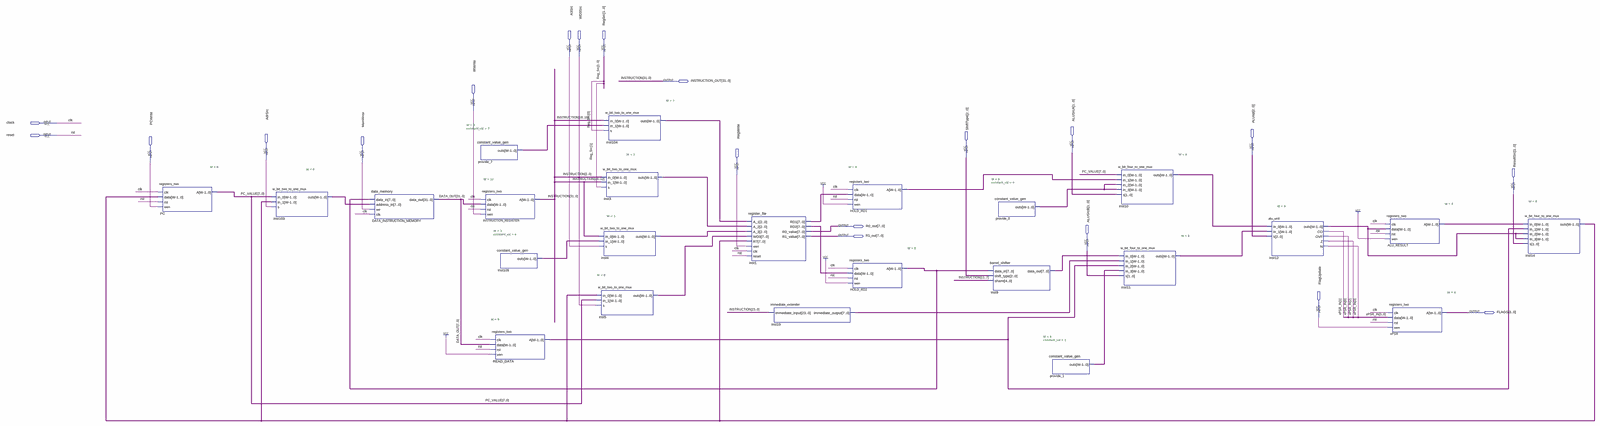
[diagram p0: schematic sheet, whole]
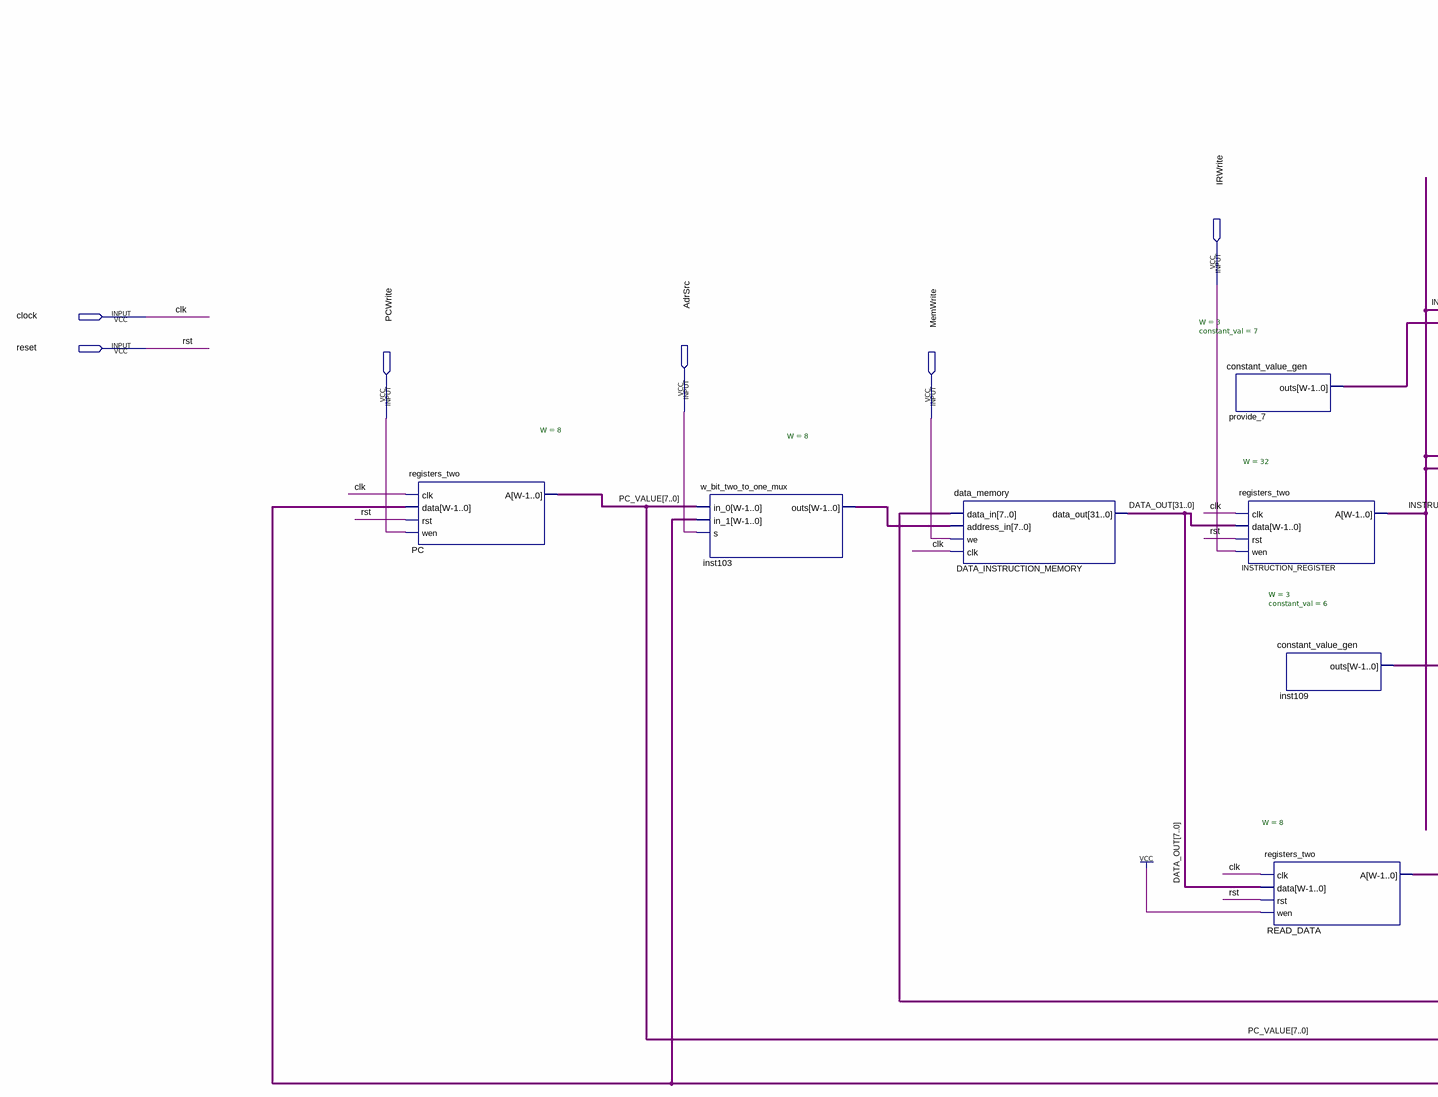
[diagram p1: schematic sheet, left part]
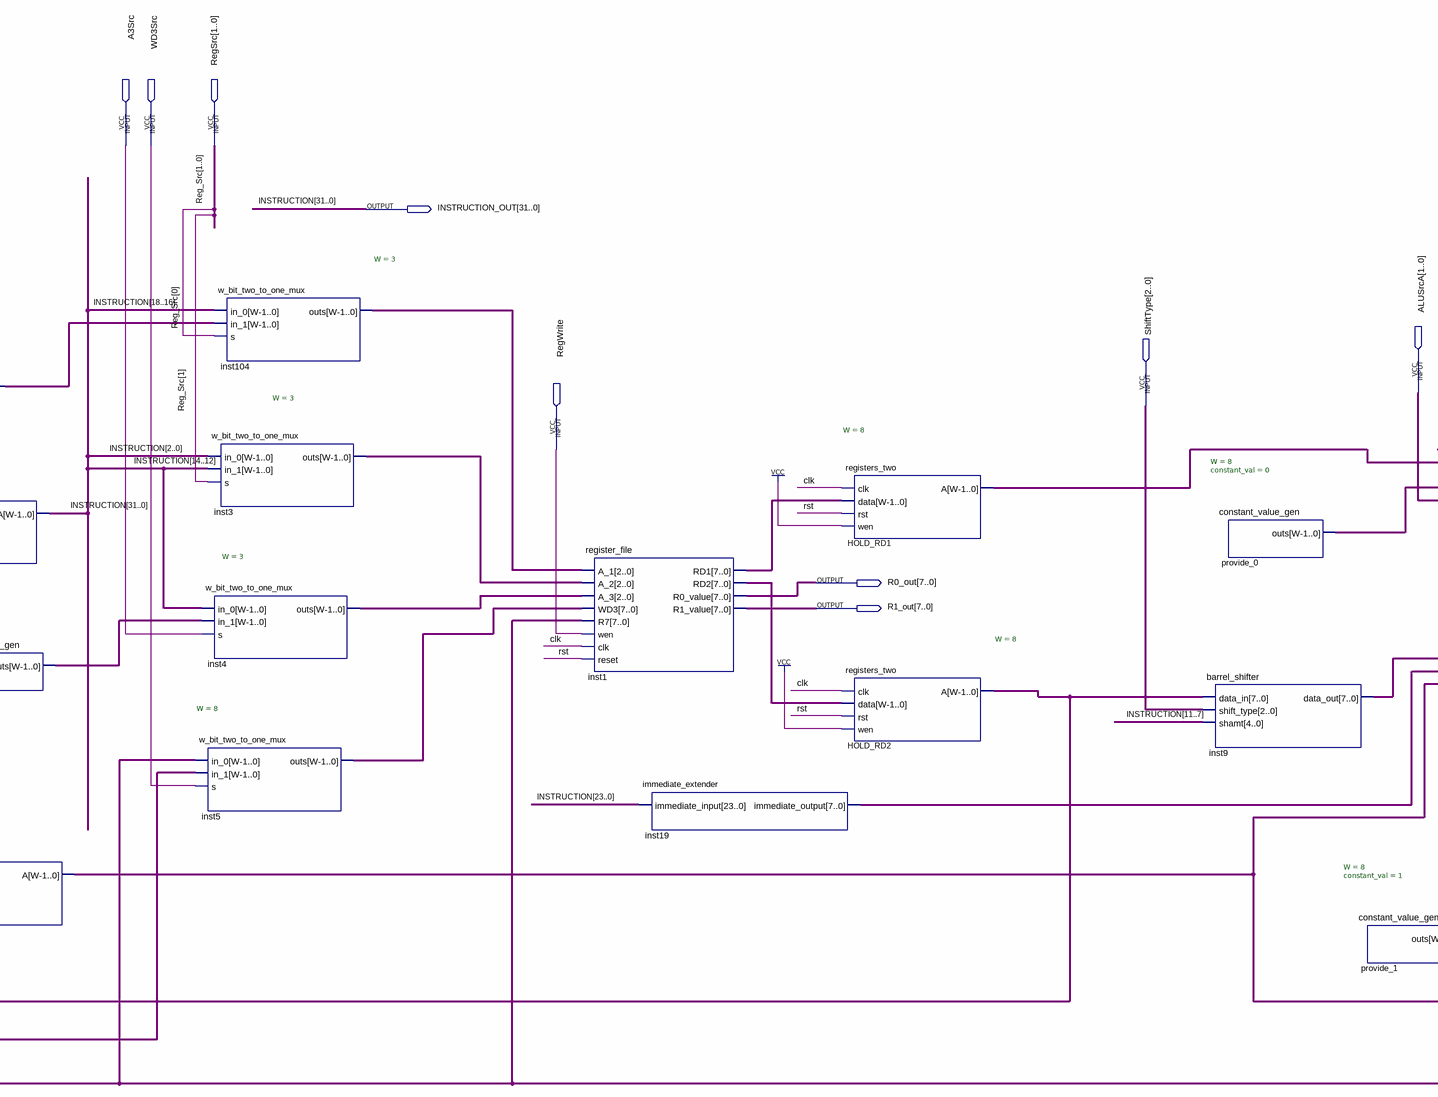
[diagram p2: schematic sheet, centre part]
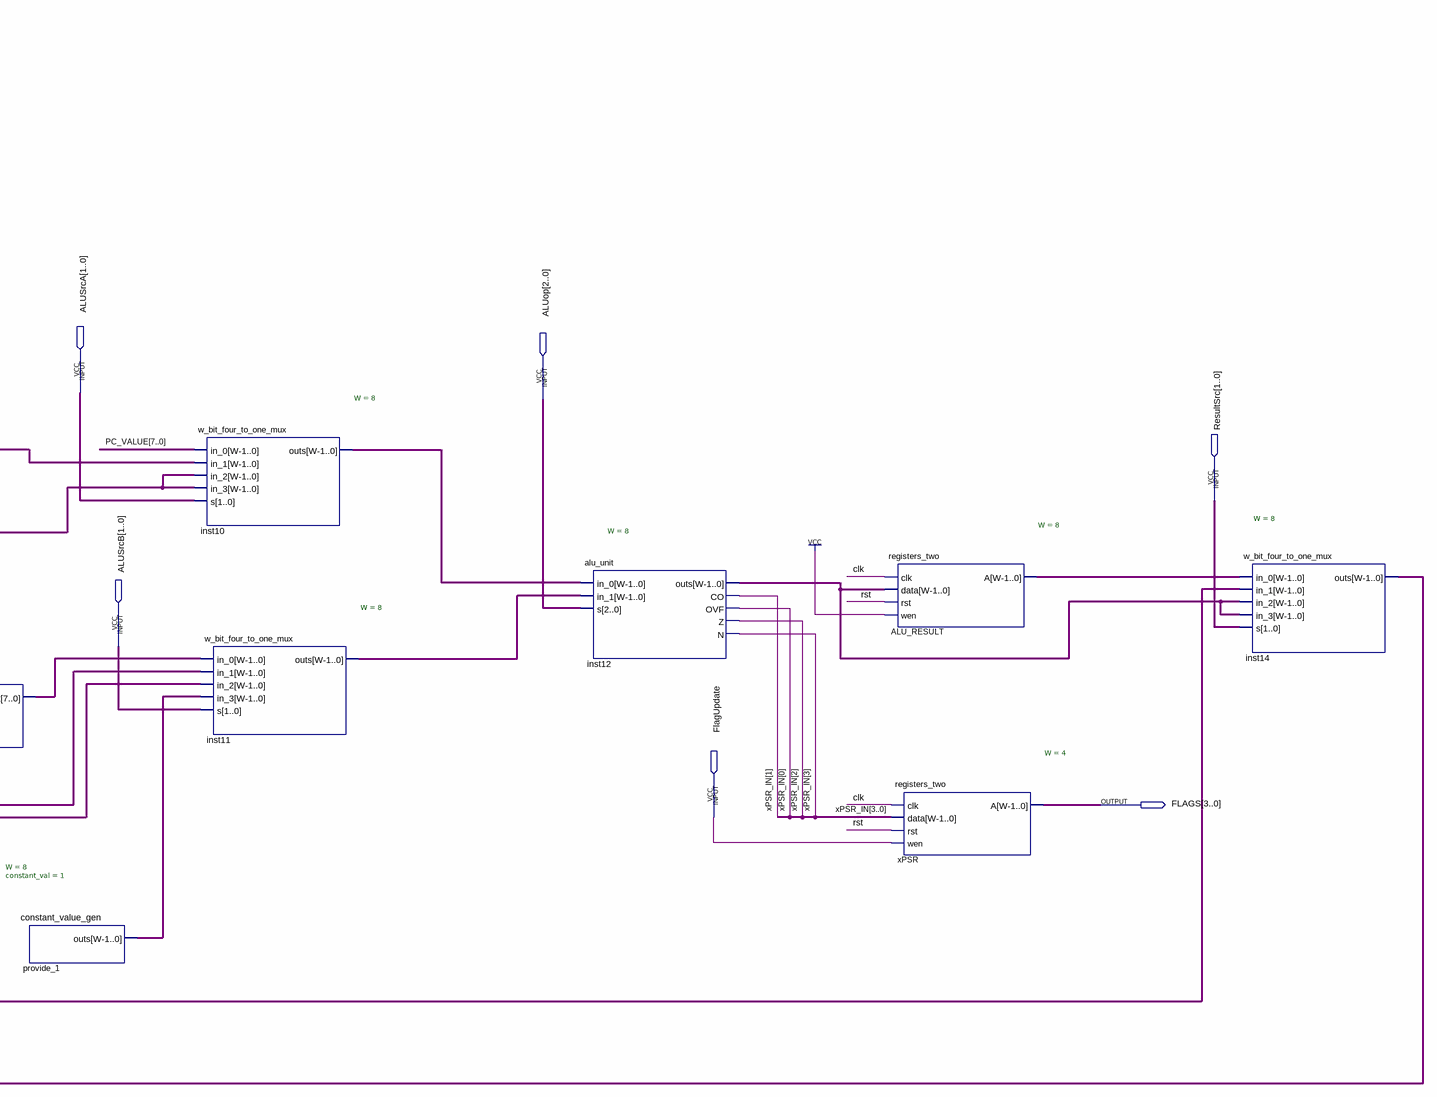
[diagram p3: schematic sheet, right part]
// Quartus schematic multicycle_computer_datapath.bdf as structural Verilog: 24 symbols, 20 pins
module multicycle_computer_datapath (
  input  A3Src,
  input  WD3Src,
  input  [1:0] RegSrc,
  input  IRWrite,
  input  clock,
  input  reset,
  input  [1:0] ALUSrcA,
  input  [2:0] ALUop,
  input  [2:0] ShiftType,
  input  AdrSrc,
  input  PCWrite,
  input  MemWrite,
  input  RegWrite,
  input  [1:0] ResultSrc,
  input  [1:0] ALUSrcB,
  input  FlagUpdate,
  output [31:0] INSTRUCTION_OUT,
  output [7:0] R0_out,
  output [7:0] R1_out,
  output [3:0] FLAGS
);

  wire [2:0] inst3_outs, inst4_outs, inst104_outs, inst109_outs, provide_7_outs;
  wire [3:0] xPSR_IN;
  wire [7:0] ALU_RESULT_a, HOLD_RD1_a, HOLD_RD2_a, inst1_rd1, inst1_rd2, inst5_outs, inst9_data_out,
       inst10_outs, inst11_outs, inst12_outs, inst14_outs, inst19_immediate_output, inst103_outs, PC_VALUE,
       provide_0_outs, provide_1_outs, READ_DATA_a;
  wire [31:0] DATA_OUT;

  registers_two #(.W(8)) PC (.clk(clock), .data(inst14_outs), .rst(reset), .wen(PCWrite), .A(PC_VALUE));
  w_bit_two_to_one_mux #(.W(8)) inst103 (.in_0(PC_VALUE), .in_1(inst14_outs), .s(AdrSrc), .outs(inst103_outs));
  data_memory DATA_INSTRUCTION_MEMORY (
    .data_in(HOLD_RD2_a), .address_in(inst103_outs), .we(MemWrite), .clk(clock), .data_out(DATA_OUT));
  constant_value_gen #(.W(3), .constant_val(7)) provide_7 (.outs(provide_7_outs));
  registers_two #(.W(32)) INSTRUCTION_REGISTER (
    .clk(clock), .data(DATA_OUT), .rst(reset), .wen(IRWrite), .A(INSTRUCTION_OUT));
  registers_two #(.W(8)) READ_DATA (.clk(clock), .data(DATA_OUT[7:0]), .rst(reset), .wen(1'b1), .A(READ_DATA_a));
  constant_value_gen #(.W(3), .constant_val(6)) inst109 (.outs(inst109_outs));
  w_bit_two_to_one_mux #(.W(3)) inst104 (
    .in_0(INSTRUCTION_OUT[18:16]), .in_1(provide_7_outs), .s(RegSrc[0]), .outs(inst104_outs));
  w_bit_two_to_one_mux #(.W(3)) inst3 (
    .in_0(INSTRUCTION_OUT[2:0]), .in_1(INSTRUCTION_OUT[14:12]), .s(RegSrc[1]), .outs(inst3_outs));
  w_bit_two_to_one_mux #(.W(3)) inst4 (
    .in_0(INSTRUCTION_OUT[14:12]), .in_1(inst109_outs), .s(A3Src), .outs(inst4_outs));
  w_bit_two_to_one_mux #(.W(8)) inst5 (.in_0(inst14_outs), .in_1(PC_VALUE), .s(WD3Src), .outs(inst5_outs));
  register_file inst1 (
    .A_1(inst104_outs), .A_2(inst3_outs), .A_3(inst4_outs), .WD3(inst5_outs), .R7(inst14_outs),
    .wen(RegWrite), .clk(clock), .reset(reset), .RD1(inst1_rd1), .RD2(inst1_rd2), .R0_value(R0_out),
    .R1_value(R1_out));
  immediate_extender inst19 (.immediate_input(INSTRUCTION_OUT[23:0]), .immediate_output(inst19_immediate_output));
  registers_two #(.W(8)) HOLD_RD1 (.clk(clock), .data(inst1_rd1), .rst(reset), .wen(1'b1), .A(HOLD_RD1_a));
  registers_two #(.W(8)) HOLD_RD2 (.clk(clock), .data(inst1_rd2), .rst(reset), .wen(1'b1), .A(HOLD_RD2_a));
  constant_value_gen #(.W(8), .constant_val(0)) provide_0 (.outs(provide_0_outs));
  barrel_shifter inst9 (
    .data_in(HOLD_RD2_a), .shift_type(ShiftType), .shamt(INSTRUCTION_OUT[11:7]), .data_out(inst9_data_out));
  constant_value_gen #(.W(8), .constant_val(1)) provide_1 (.outs(provide_1_outs));
  w_bit_four_to_one_mux #(.W(8)) inst10 (
    .in_0(PC_VALUE), .in_1(HOLD_RD1_a), .in_2(provide_0_outs), .in_3(provide_0_outs), .s(ALUSrcA),
    .outs(inst10_outs));
  w_bit_four_to_one_mux #(.W(8)) inst11 (
    .in_0(inst9_data_out), .in_1(inst19_immediate_output), .in_2(READ_DATA_a), .in_3(provide_1_outs),
    .s(ALUSrcB), .outs(inst11_outs));
  alu_unit #(.W(8)) inst12 (
    .in_0(inst10_outs), .in_1(inst11_outs), .s(ALUop), .outs(inst12_outs), .CO(xPSR_IN[1]), .OVF(xPSR_IN[0]),
    .Z(xPSR_IN[2]), .N(xPSR_IN[3]));
  registers_two #(.W(8)) ALU_RESULT (.clk(clock), .data(inst12_outs), .rst(reset), .wen(1'b1), .A(ALU_RESULT_a));
  registers_two #(.W(4)) xPSR (.clk(clock), .data(xPSR_IN), .rst(reset), .wen(FlagUpdate), .A(FLAGS));
  w_bit_four_to_one_mux #(.W(8)) inst14 (
    .in_0(ALU_RESULT_a), .in_1(READ_DATA_a), .in_2(inst12_outs), .in_3(inst12_outs), .s(ResultSrc),
    .outs(inst14_outs));

  // Other names for the same wires on the sheet: clk = clock; INSTRUCTION[31:0] = INSTRUCTION_OUT;
  //   Reg_Src[1:0] = RegSrc; rst = reset
endmodule
